# EAGLE design HoneyBee-V1.2 (EAGLE 9.6.2)
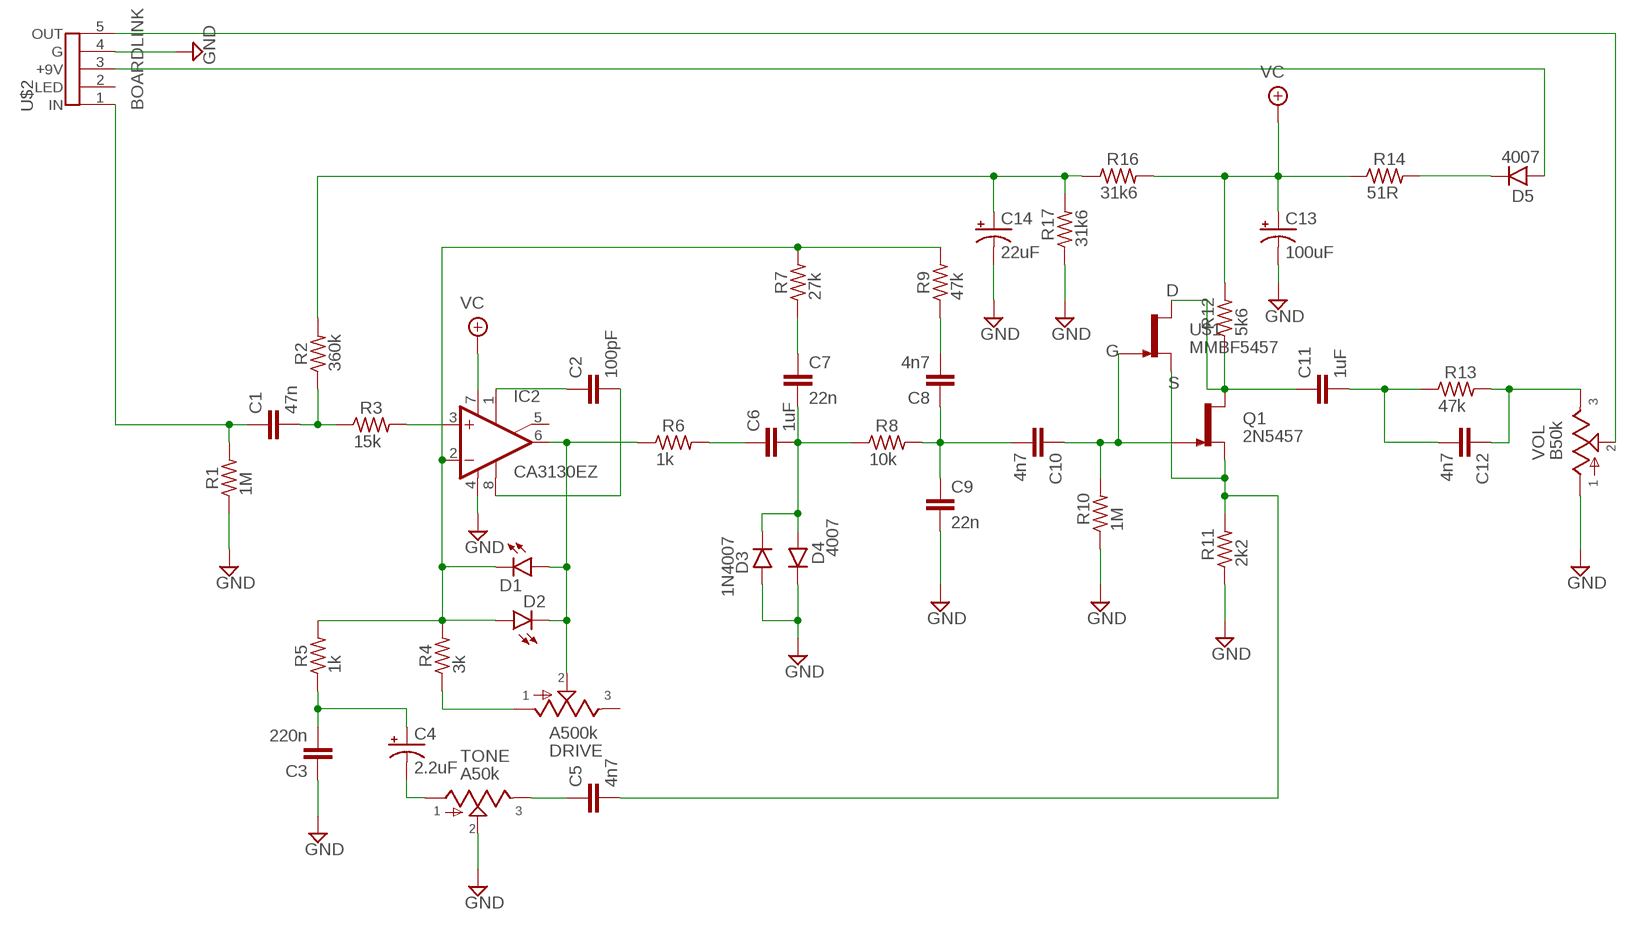
[diagram p0: schematic, sheet 1]

## Parts
C1  47n  075X0402  [075X040]
C2  100pF  050X030_0251  [050X030_025]
C3  220n  080X0502  [080X050]
C4  2.2uF  0501  [050_020_1]
C5  4n7  070X0302  [070X030]
C6  1uF  080X0502  [080X050]
C7  22n  075X0302  [075X030]
C8  4n7  070X0302  [070X030]
C9  22n  075X0302  [075X030]
C10  4n7  070X0302  [070X030]
C11  1uF  080X0502  [080X050]
C12  4n7  070X0302  [070X030]
C13  100uF  0801  [080_035_1]
C14  22uF  0501  [050_020_1]
D1  LED3MM  [LED3MM]
D2  LED3MM  [LED3MM]
D3  1N4007  1N400X.3  [DO41-3]
D4  4007  1N400X.3  [DO41-3]
D5  4007  1N400X.3  [DO41-3]
DRIVE  A500k  POT16MM  [16MM]
IC2  CA3130EZ  CA3130EZLMP  [DIL08]
Q1  2N5457  [TO92-]
R1  1M  6MM.3  [R0207/3]
R2  360k  6MM.3  [R0207/3]
R3  15k  6MM.3  [R0207/3]
R4  3k  6MM.3  [R0207/3]
R5  1k  6MM.3  [R0207/3]
R6  1k  6MM.3  [R0207/3]
R7  27k  6MM.3  [R0207/3]
R8  10k  6MM.3  [R0207/3]
R9  47k  6MM.3  [R0207/3]
R10  1M  6MM.3  [R0207/3]
R11  2k2  6MM.3  [R0207/3]
R12  5k6  6MM.3  [R0207/3]
R13  47k  6MM.3  [R0207/3]
R14  51R  6MM.3  [R0207/3]
R16  31k6  6MM.3  [R0207/3]
R17  31k6  6MM.3  [R0207/3]
TONE  A50k  POT16MM  [16MM]
U$1  MMBF5457  [SOT23]
U$2  BOARDLINK  [BOARDLINK]
VOL  B50k  POT16MM  [16MM]

## Nets
GND: C3.1 C9.2 C13.- C14.- D3.A D4.C IC2.4(V-) R1.1 R10.1 R11.1 R17.1 TONE.2 U$2.4(G) VOL.1
N$1: C1.2 R2.1 R3.1
N$2: IC2.3(+IN) R3.2
N$3: C3.2 C4.+ R5.1
N$4: D1.K(C) D2.A IC2.2(-IN) R4.2 R5.2 R7.2 R9.2
N$5: C4.- TONE.1
N$6: C5.1 TONE.3
N$7: C6.1 R6.2
N$8: D1.A D2.K(C) DRIVE.2 IC2.6(OUT) R6.1
N$9: DRIVE.1 R4.1
N$10: C2.1 IC2.1(ON1)
N$11: C2.2 IC2.8(OPT)
N$12: C6.2 C7.2 D3.C D4.A R8.1
N$13: C7.1 R7.1
N$14: C8.1 C9.1 C10.2 R8.2
N$15: C8.2 R9.1
N$16: C10.1 Q1.1(G) R10.2 U$1.3(G)
N$17: C5.2 Q1.2(S) R11.2 U$1.2(S)
N$18: C11.1 Q1.3(D) R12.1 U$1.1(D)
N$19: C14.+ R2.2 R16.1 R17.2
N$20: C1.1 R1.2 U$2.1(IN)
N$21: C11.2 C12.2 R13.1
N$22: C12.1 R13.2 VOL.3
N$23: D5.C R14.2
N$24: D5.A U$2.3(+9V)
N$25: U$2.5(OUT) VOL.2
VC: C13.+ IC2.7(V+) R12.2 R14.1 R16.2
Unconnected: DRIVE.3 IC2.5(ON2) U$2.2(LED)

## Library data of the parts
C1 = mb_caps-chicklet:075X040: 0.039 - 0.047uF Panasonic ECQ-B 7mm x 4mm 50V: 0.039 - 0.047uF;
C2 = mb_caps-ceramic:050X030_025: 47 - 120pF Xicon Ceramic Disc 2.5mm lead spacing
C3 C6 C11 = mb_caps-chicklet:080X050: 0.1uF Panasonic ECQ-B 8mm x 5mm
C4 C14 = mb_caps-electro:050: 0.22 - 100uF Xicon values at Mouser.com: 10V: 10 - 100uF; 16V: 2.2 - 47uF; 25V: 0.47 - 47uF; 50V: 0.22 - 22uF
C5 C8 C10 C12 = mb_caps-chicklet:070X030: 0.0001 - .01uF (100 - 10,000pF) Panasonic ECQ-B 7mm x 3mm 50 or 63V: 0.0001 - .01uF (100 - 10,000pF);
C7 C9 = mb_caps-chicklet:075X030: 0.015 - 0.022uF Panasonic ECQ-B 7.5mm x 3mm 50 or 63V: 0.015 - 0.022uF;
C13 = mb_caps-electro:080: 47 - 470uF Xicon values at Mouser.com 10V: 330, 470uF; 16V: 220, 330uF; 25V: 220uF; 50V: 47, 100uF
D1 D2 = mb_diodes:LED
D3-D5 = mb_diodes:1N400X: Rectifier Diodes often used in power supply to prevent damage from reverse polarization
DRIVE TONE VOL = mb_pots:POT: Potentiometers the arrow indicates the clockwise motion of th wiper (lug 2) fully counter clockwise there is no resistance between lugs 1 and 2 fully clockwise the resistance between lugs 1 and 2 is the value of the pot
IC2 = mb_ics:CA3130EZ: OP AMP
Q1 = mb_trans:2N5457: N-CHANNEL JFET
R1-R14 R16 R17 = mb_resistors:6MM: 6mm Resistors Leads spaced 1-6 holes apart for 0.1" perfboard. Suitable for 1/4 watt resistors.
U$1 = xc_library:MMBF5457: MMBF5457/5458/5459
U$2 = xc_library:BOARDLINK

## Board
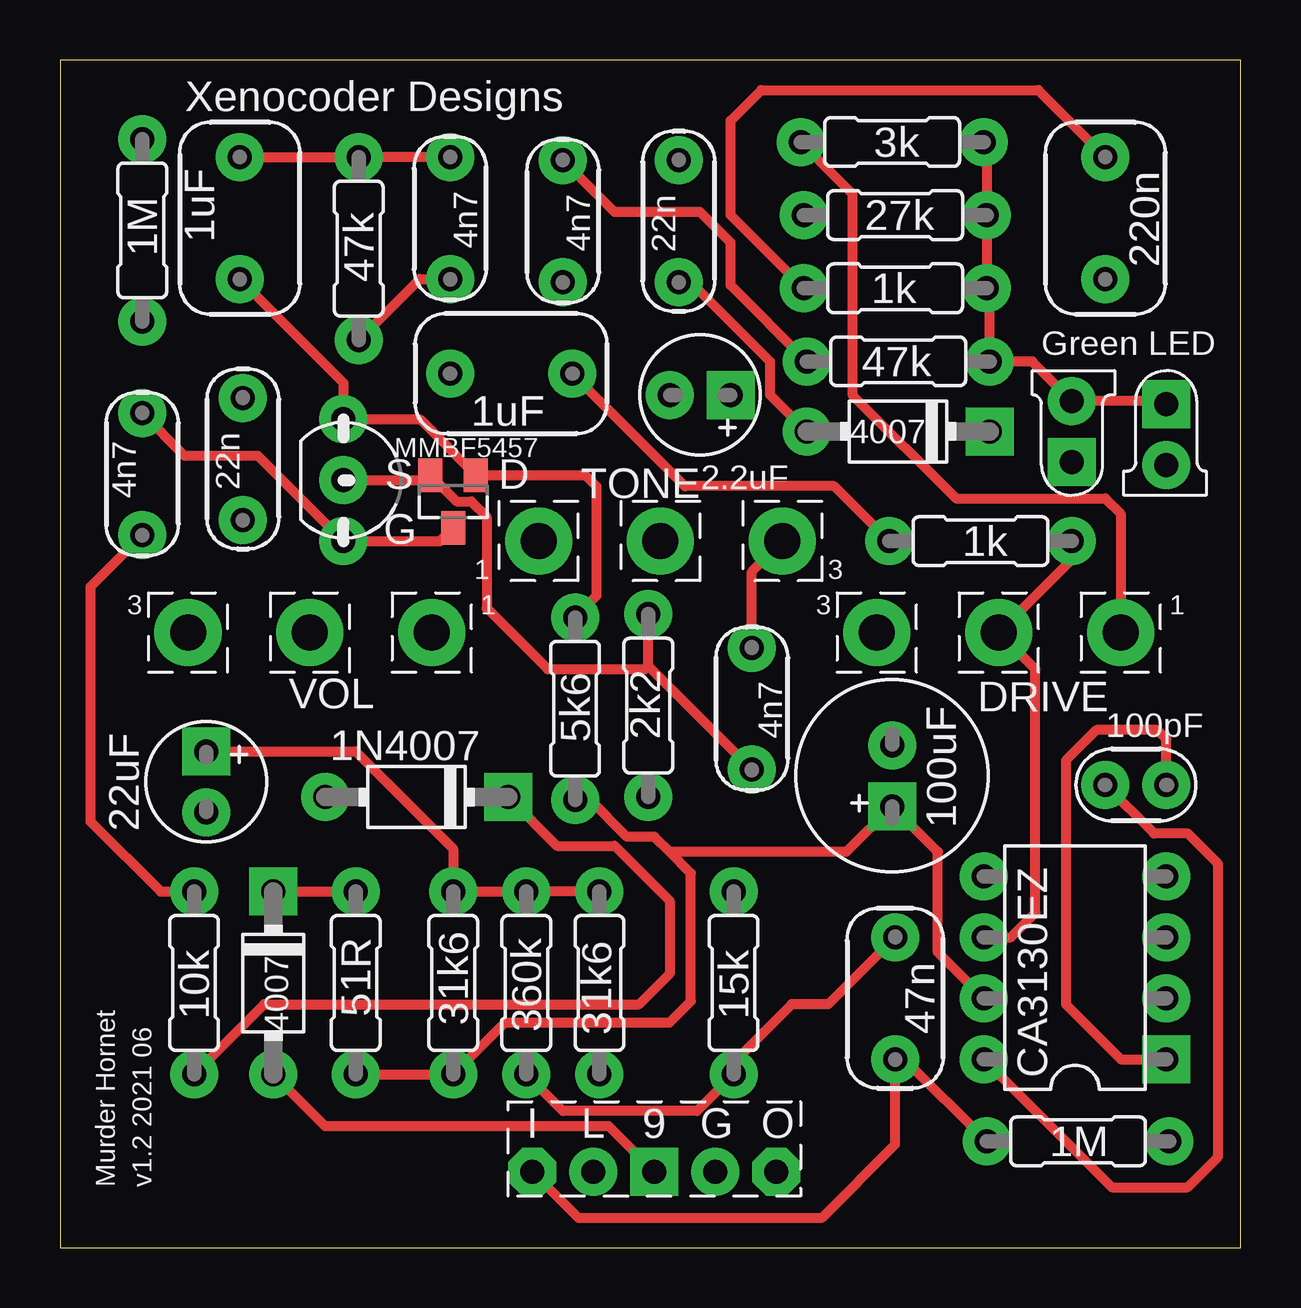
[diagram p1: board, top side]
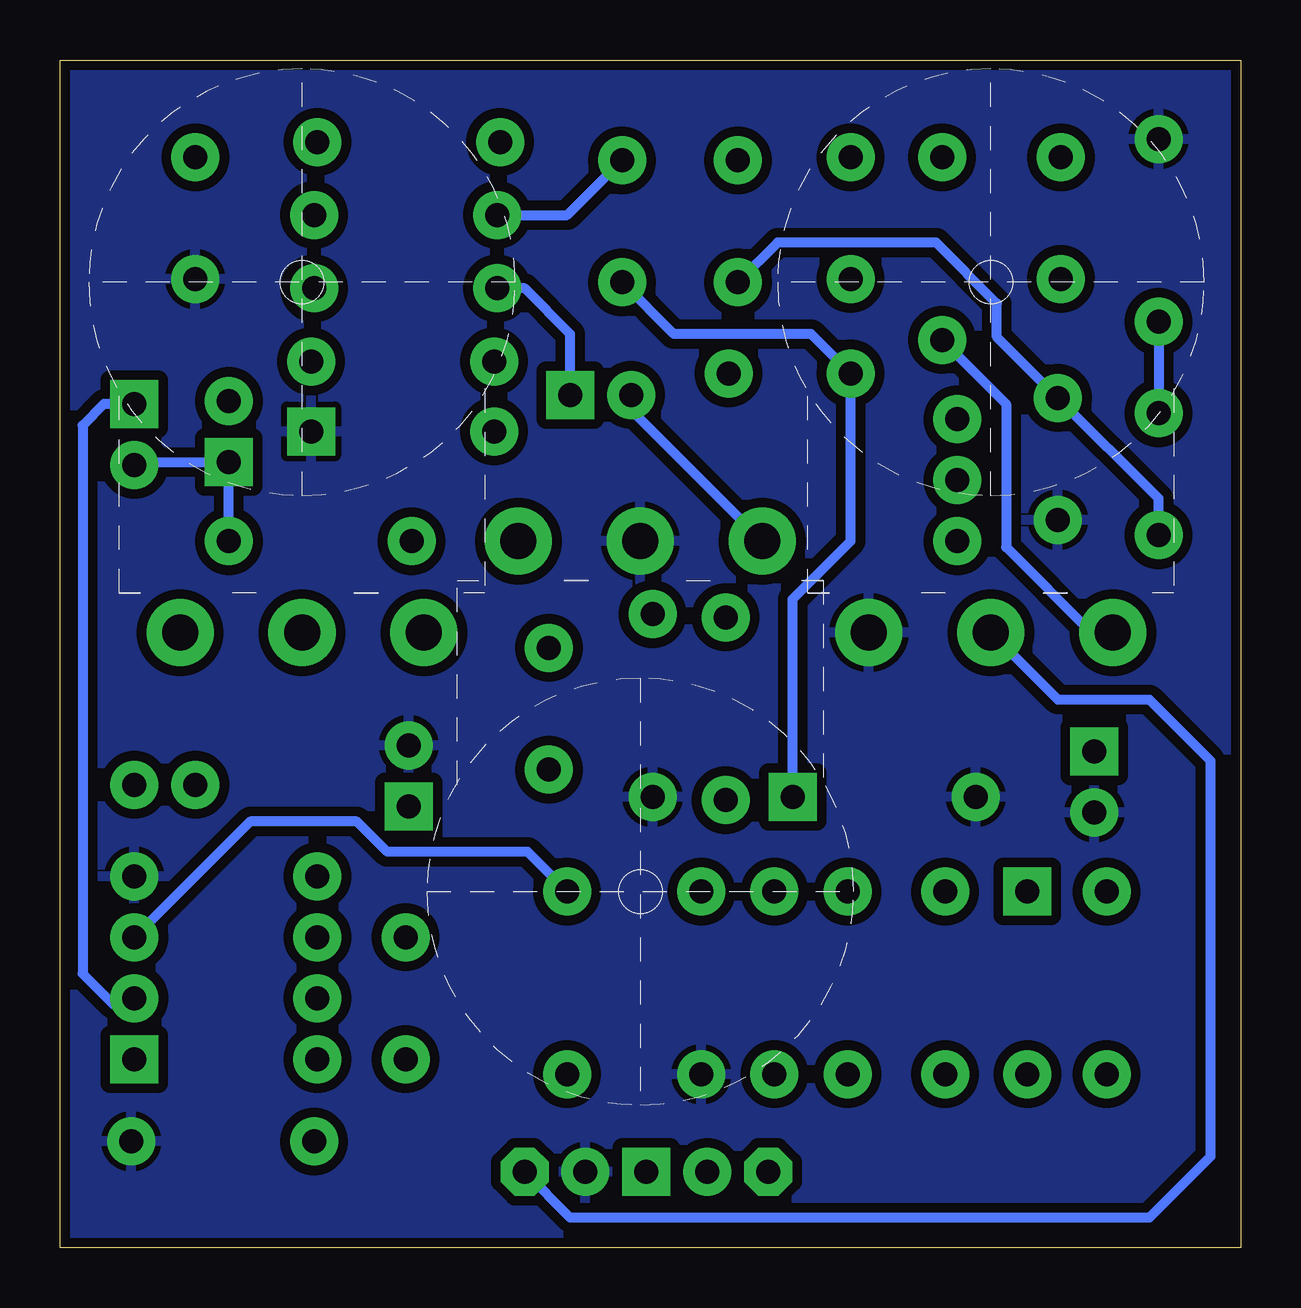
[diagram p2: board, bottom side, seen from below]

Size 49.2 x 49.52 mm. Coordinates in mm from the lower left corner, seen from the top.
Outline: 0,0 49.2,0 49.2,49.52 0,49.52 0,0
Copper layers (1*16): Top 0.0356mm / dielectric 1.5011mm / Bottom 0.0356mm
Design rules "LaenPCBOrder": minimum track width 6mil, minimum drill 13mil, track to track 6mil, track to pad 6mil, pad to pad 6mil, via to via 6mil, smd to smd 6mil, copper to edge 15mil, drill to drill 6mil, minimum pad ring 7mil, minimum via ring 7mil, stop-mask expansion 3mil, vias tented up to drill 0mil, thermal gap 10mil

### Footprints (pad centres in the part's own frame; a part is rotated, then mirrored left to right if it is on the bottom)
075X040 = drill 1 pad 2: 1 -2.54,0; 2 2.54,0
050X030_025 = drill 1 pad 2: 1 -1.27,0; 2 1.27,0
080X050 = drill 1 pad 2: 1 -2.54,0; 2 2.54,0
050_020_1 = drill 1 pad 2 square: + -1.27,0 | drill 1 pad 2: - 1.27,0
070X030 = drill 1 pad 2: 1 -2.54,0; 2 2.54,0
075X030 = drill 1 pad 2: 1 -2.54,0; 2 2.54,0
080_035_1 = drill 1 pad 2 square: + -1.27,0 | drill 1 pad 2: - 1.27,0
LED3MM = drill 1 pad 2 square: A -1.27,0 | drill 1 pad 2: K 1.27,0
DO41-3 = drill 1 pad 2: A 3.81,0 | drill 1 pad 2 square: C -3.81,0
16MM = drill 1.5 pad 2.794: 1 5.08,0; 2 0,0; 3 -5.08,0
DIL08 = drill 1 pad 2 square: 1 -3.81,-3.81 | drill 1 pad 2: 2 -1.27,-3.81; 3 1.27,-3.81; 4 3.81,-3.81; 5 3.81,3.81; 6 1.27,3.81; 7 -1.27,3.81; 8 -3.81,3.81
TO92- = drill 1 pad 2: 1 2.54,0; 2 0,0; 3 -2.54,0
R0207/3 = drill 1 pad 2: 1 -3.81,0; 2 3.81,0
SOT23 = smd 1 x 1.4: 1 -0.95,-1.1; 2 0.95,-1.1; 3 0,1.1
BOARDLINK = drill 1 pad 2 octagon: 1 -2.54,0; 5 7.62,0 | drill 1 pad 2: 2 0,0; 4 5.08,0 | drill 1 pad 2 square: 3 2.54,0

### Placement (x,y rotation side)
C1  34.8,10.41 90 top
C2  44.83,19.3 180 top
C3  43.56,42.93 90 top
C4  26.67,35.56 180 top
C5  28.83,22.48 270 top
C6  18.8,36.45 180 top
C7  25.78,42.8 270 top
C8  20.95,42.8 90 top
C9  7.62,32.89 270 top
C10  3.43,32.26 270 top
C11  7.49,42.93 90 top
C12  16.26,42.93 90 top
C13  34.67,19.68 90 top
C14  6.1,19.43 270 top
D1  42.16,34.04 90 top
D2  46.1,33.91 270 top
D3  14.86,18.8 180 top
D4  34.92,34.04 180 top
D5  8.89,11.05 270 top
DRIVE  39.12,25.65 0 top
IC2  42.29,11.68 90 top
Q1  11.81,32 270 top
R1  42.42,4.45 180 top
R2  19.43,11.05 90 top
R3  28.07,11.05 90 top
R4  34.67,46.1 0 top
R5  34.8,40.01 0 top
R6  38.35,29.46 180 top
R7  34.8,43.05 0 top
R8  5.59,11.05 90 top
R9  34.92,36.96 0 top
R10  3.43,42.42 270 top
R11  24.51,22.61 90 top
R12  21.46,22.48 270 top
R13  12.45,41.66 270 top
R14  12.32,11.05 90 top
R16  16.38,11.05 270 top
R17  22.48,11.05 90 top
TONE  25.02,29.46 180 top
U$1  16.38,31.11 180 top
U$2  22.23,3.17 0 top
VOL  10.41,25.65 0 top

### Tracks (layer width: path | path; a pad name or v marks a point on that pad's centre or on a via)
GND
  pour Bottom (isolate 0.406): 0,49.53 49.53,49.53 49.53,0 0,0
N$1
  Top 0.406: R2.1 20.95,5.71 26.54,5.71 R3.1 28.07,7.75 30.48,10.16 32,10.16 C1.2
N$2
  Bottom 0.406: R3.2 29.72,16.51 35.56,16.51 36.83,17.78 41.27,17.78 IC2.3
N$3
  Top 0.406: R5.1 27.94,43.05 27.94,46.99 29.21,48.26 40.77,48.26 C3.2
  Bottom 0.406: C4.+ 27.94,38.1 29.84,40.01 R5.1
N$4
  Top 0.406: D2.A 45.97,35.31 D1.K 40.51,36.96 R9.2 38.73,39.88 | R4.2 38.61,45.97 R7.2 R5.2 | 38.73,39.88 R5.2 | R5.2 38.73,39.88
  Bottom 0.406: D2.A 47.37,35.18 48.26,34.29 48.26,11.43 46.99,10.16 46.35,10.16 IC2.2
N$5
  Bottom 0.406: TONE.1 25.4,34.92 C4.-
N$6
  Top 0.406: C5.1 28.83,28.19 TONE.3
N$7
  Top 0.406: R6.2 32.26,31.75 26.04,31.75 C6.1
N$8
  Top 0.406: R6.1 42.16,28.7 DRIVE.2 40.64,24.13 40.64,13.97 39.62,12.95 IC2.6
  Bottom 0.406: R6.1 D1.A 45.97,32.77 D2.K
N$9
  Top 0.406: R4.1 33.02,43.94 33.02,35.56 37.34,31.24 43.56,31.24 44.2,30.61 DRIVE.1
N$10
  Top 0.406: C2.1 46.1,21.21 45.72,21.59 43.18,21.59 41.91,20.32 41.91,10.16 44.2,7.87 IC2.1
N$11
  Top 0.406: IC2.8 43.81,2.54 46.99,2.54 48.26,3.81 48.26,16 46.99,17.27 45.59,17.27 C2.2
N$12
  Top 0.406: D4.A 29.59,35.56 29.59,36.96 26.29,40.26 C7.2 | R8.1 8.51,10.16 24.13,10.16 25.4,11.43 25.4,14.48 23.11,16.76 20.7,16.76 D3.C
  Bottom 0.406: C7.2 23.62,38.1 17.91,38.1 C6.2 16.26,29.46 18.67,27.05 D3.C
N$13
  Bottom 0.406: R7.1 28.07,43.05 C7.1
N$14
  Top 0.406: C10.2 1.27,27.56 1.27,17.78 4.19,14.86 R8.2
  Bottom 0.406: C8.1 19.3,41.91 12.7,41.91 10.16,39.37 10.16,37.97 C9.1 3.43,31.24 C10.2
N$15
  Top 0.406: R9.1 27.94,40.13 27.94,41.91 26.67,43.18 23.11,43.18 C8.2
N$16
  Top 0.406: C10.1 5.21,33.02 8.26,33.02 Q1.1 15.83,29.46 U$1.3
  Bottom 0.406: R10.2 C10.1
N$17
  Top 0.406: C5.2 24.51,24.26 | 24.51,24.26 R11.2 | Q1.2 15.22,32 U$1.2 16.53,31.11 17.14,31.11 17.78,30.48 17.78,26.67 20.32,24.13 24.38,24.13 24.51,24.26
N$18
  Top 0.406: C11.1 11.81,36.07 Q1.3 15,34.54 U$1.1 21.89,32.22 22.35,31.75 22.35,27.18 R12.1
N$19
  Top 0.406: R17.2 R2.2 R16.1 16.38,16.64 12.32,20.7 C14.+
N$20
  Top 0.406: R1.2 35.18,7.87 C1.1 34.8,4.32 31.75,1.27 21.59,1.27 U$2.1
N$21
  Top 0.406: C11.2 R13.1 C12.2
N$22
  Top 0.406: R13.2 14.99,40.39 C12.1
  Bottom 0.406: R13.2 9.78,35.18 9.78,29.21 6.22,25.65 VOL.3
N$23
  Top 0.406: D5.C R14.2
N$24
  Top 0.406: U$2.3 22.86,5.08 11.05,5.08 D5.A
N$25
  Bottom 0.406: VOL.2 7.62,22.86 3.81,22.86 1.27,20.32 1.27,3.81 3.81,1.27 27.94,1.27 U$2.5
VC
  Top 0.406: 25.4,16.51 26.29,15.62 26.29,10.29 25.4,9.4 18.54,9.4 R16.2 R14.1 | 25.4,16.51 24.77,17.14 23.62,17.14 22.1,18.67 R12.2 | IC2.7 36.58,12.32 36.58,16.51 C13.+ 32.77,16.51 25.4,16.51

### Text on the board
tPlace: Xenocoder Designs
tNames: Green LED | Murder Hornet | v1.2 2021 06